# EAGLE design main_unit_shield (EAGLE 7.2.0)
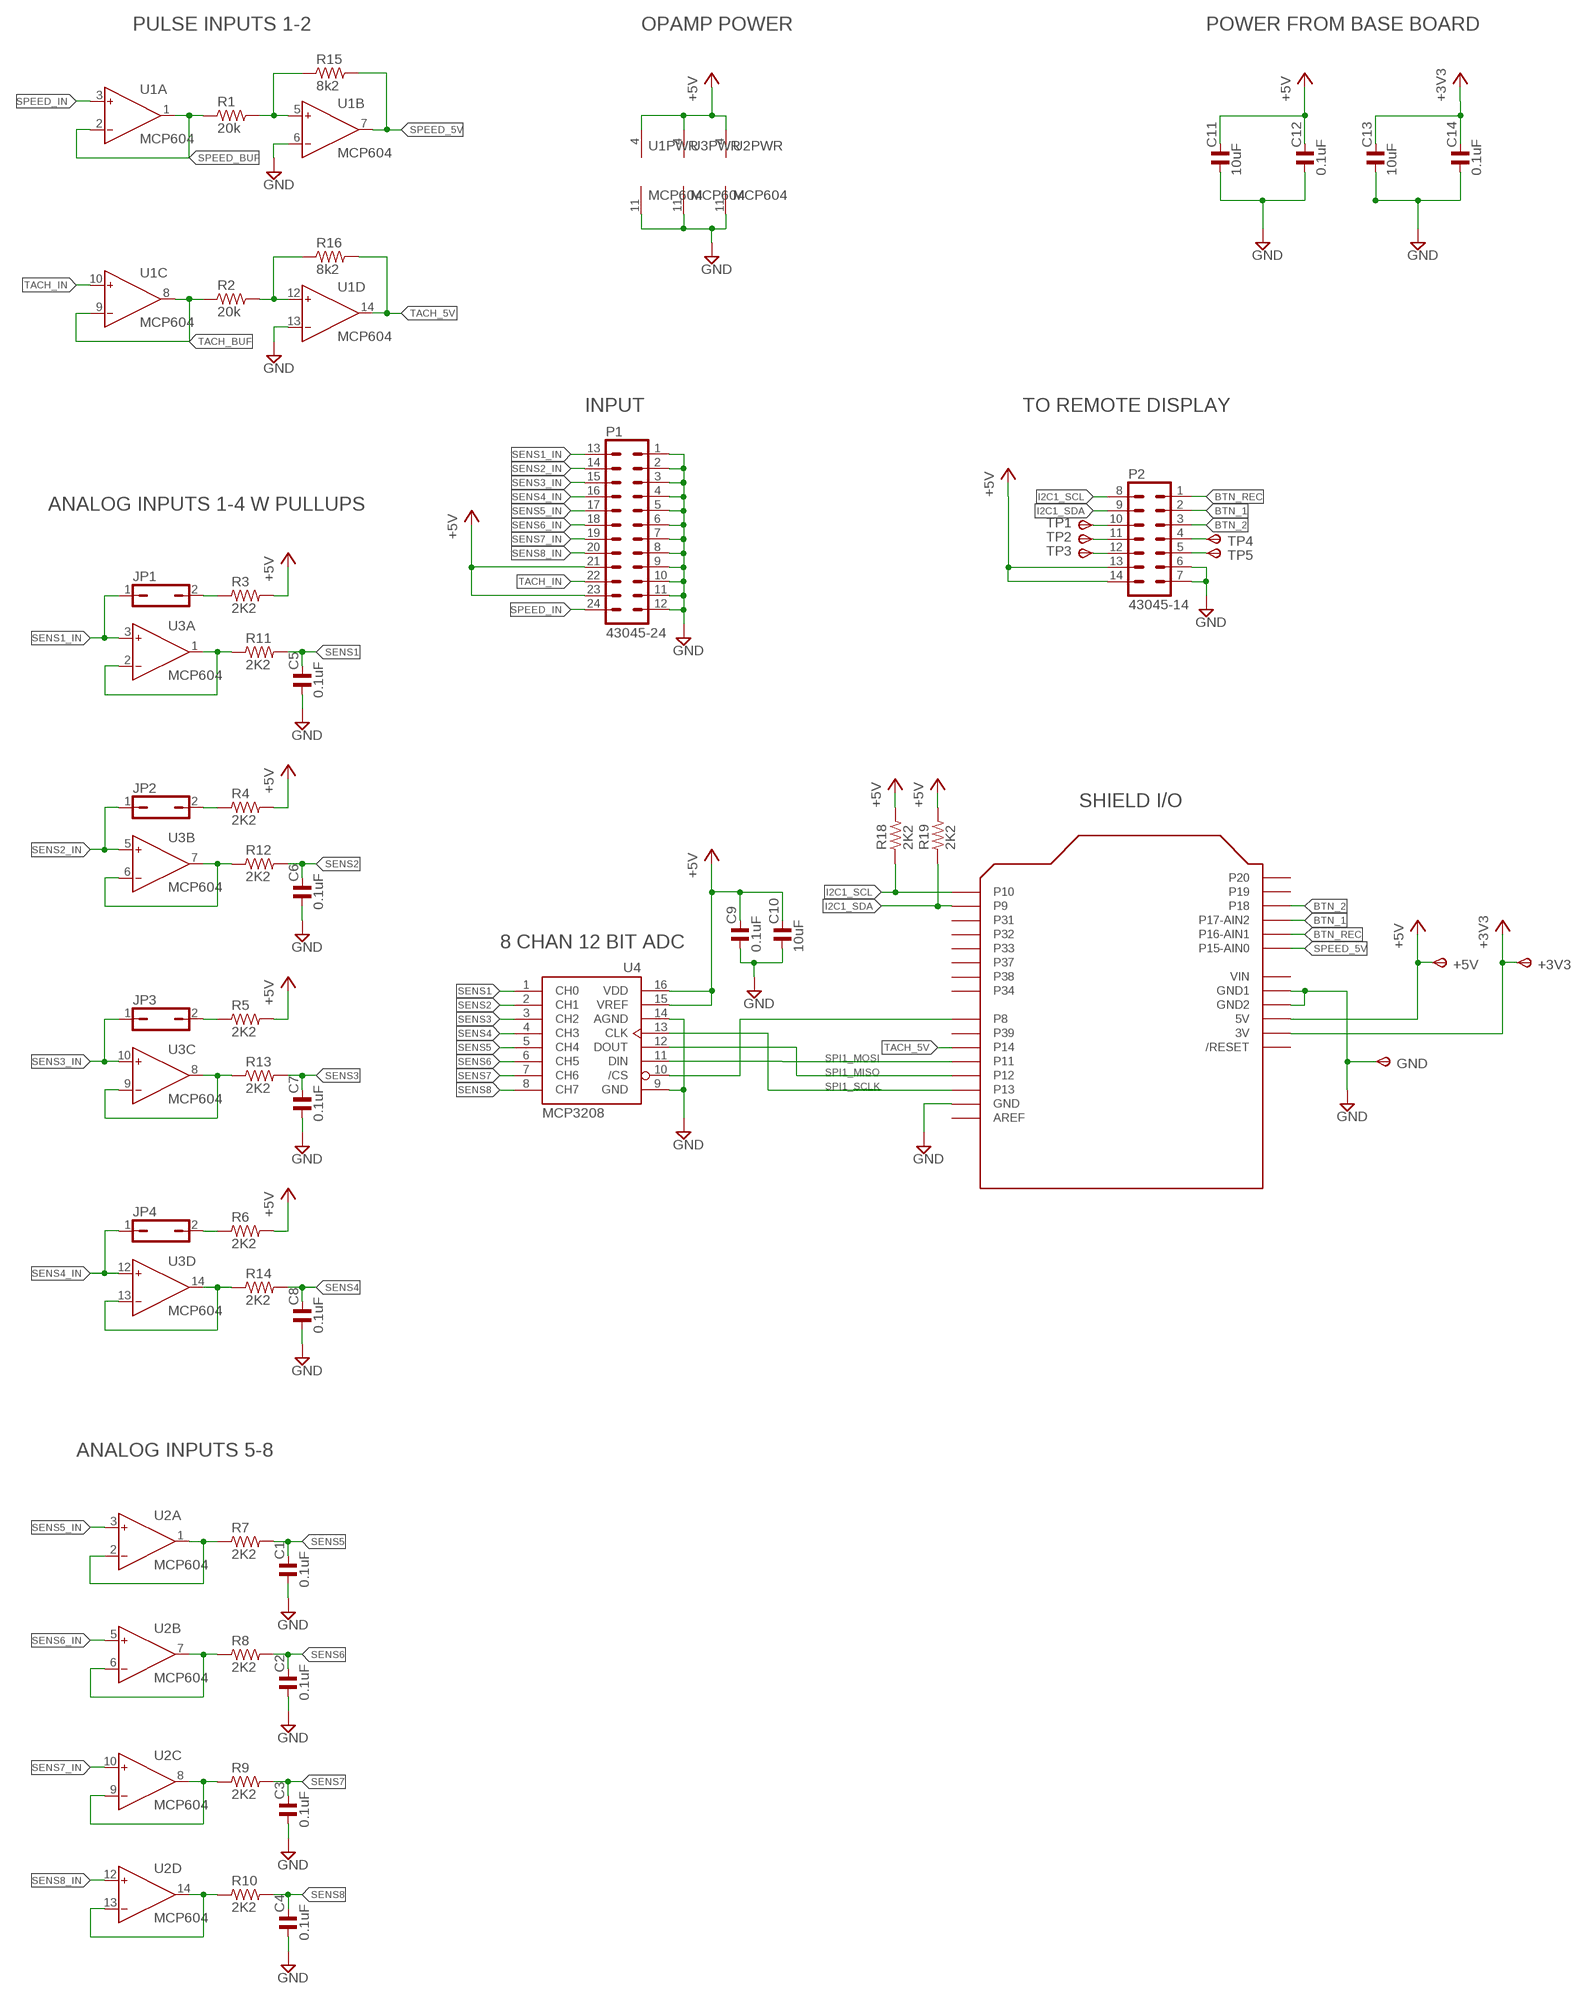
[diagram p0: schematic, sheet 1]

## Parts
+3V3  TPSPAD1-13  [P1-13]
+5V  TPSPAD1-13  [P1-13]
C1  0.1uF  C_0805  [C0805]
C2  0.1uF  C_0805  [C0805]
C3  0.1uF  C_0805  [C0805]
C4  0.1uF  C_0805  [C0805]
C5  0.1uF  C_0805  [C0805]
C6  0.1uF  C_0805  [C0805]
C7  0.1uF  C_0805  [C0805]
C8  0.1uF  C_0805  [C0805]
C9  0.1uF  C_0805  [C0805]
C10  10uF  C_0805  [C0805]
C11  10uF  C_0805  [C0805]
C12  0.1uF  C_0805  [C0805]
C13  10uF  C_0805  [C0805]
C14  0.1uF  C_0805  [C0805]
GND  TPSPAD1-13  [P1-13]
JP1  JP1Q  [JP1]
JP2  JP1Q  [JP1]
JP3  JP1Q  [JP1]
JP4  JP1Q  [JP1]
P1  43045-24  [43045-24]
P2  43045-14  [43045-14]
R1  20k  R_0805  [R0805]
R2  20k  R_0805  [R0805]
R3  2K2  R_0805  [R0805]
R4  2K2  R_0805  [R0805]
R5  2K2  R_0805  [R0805]
R6  2K2  R_0805  [R0805]
R7  2K2  R_0805  [R0805]
R8  2K2  R_0805  [R0805]
R9  2K2  R_0805  [R0805]
R10  2K2  R_0805  [R0805]
R11  2K2  R_0805  [R0805]
R12  2K2  R_0805  [R0805]
R13  2K2  R_0805  [R0805]
R14  2K2  R_0805  [R0805]
R15  8k2  R_0805  [R0805]
R16  8k2  R_0805  [R0805]
R18  2K2  R_0805  [R0805]
R19  2K2  R_0805  [R0805]
TP1  TPSPAD1-13  [P1-13]
TP2  TPSPAD1-13  [P1-13]
TP3  TPSPAD1-13  [P1-13]
TP4  TPSPAD1-13  [P1-13]
TP5  TPSPAD1-13  [P1-13]
U1  MCP604  [SO14]
U2  MCP604  [SO14]
U3  MCP604  [SO14]
U4  MCP3208  [SO16]
U5  ARDUINOUNO  [ARDUINO]

## Nets
+3V3: +3V3.TP(PP) C13.2 C14.2 U5.3V
+5V: +5V.TP(PP) C9.2 C10.2 C11.2 C12.2 P1.21 P1.23 P2.13 P2.14 R3.2 R4.2 R5.2 R6.2 R18.2 R19.2 U1.4(PWR:V+) U2.4(PWR:V+) U3.4(PWR:V+) U4.15(VREF) U4.16(VDD) U5.5V
BTN_1: P2.2 U5.A2(P17-AIN2)
BTN_2: P2.3 U5.A3(P18)
BTN_REC: P2.1 U5.A1(P16-AIN1)
GND: C1.1 C2.1 C3.1 C4.1 C5.1 C6.1 C7.1 C8.1 C9.1 C10.1 C11.1 C12.1 C13.1 C14.1 GND.TP(PP) P1.1 P1.2 P1.3 P1.4 P1.5 P1.6 P1.7 P1.8 P1.9 P1.10 P1.11 P1.12 P2.6 P2.7 U1.6(B:IN-) U1.11(PWR:V-) U1.13(D:IN-) U2.11(PWR:V-) U3.11(PWR:V-) U4.9(GND) U4.14(AGND) U5.GND U5.GND1 U5.GND2
I2C1_SCL: P2.8 R18.1 U5.D0(P10)
I2C1_SDA: P2.9 R19.1 U5.D1(P9)
N$1: R1.2 R15.1 U1.5(B:IN+)
N$3: R2.2 R16.1 U1.12(D:IN+)
N$6: U4.10(/CS) U5.D8(P8)
N$10: JP1.2 R3.1
N$22: JP3.2 R5.1
N$24: P2.10 TP1.TP(PP)
N$25: P2.11 TP2.TP(PP)
N$26: JP2.2 R4.1
N$28: P2.12 TP3.TP(PP)
N$31: JP4.2 R6.1
N$33: P2.4 TP4.TP(PP)
N$36: P2.5 TP5.TP(PP)
SENS1: C5.2 R11.2 U4.1(CH0)
SENS1_BUF: R11.1 U3.1(A:OUT) U3.2(A:IN-)
SENS1_IN: JP1.1 P1.13 U3.3(A:IN+)
SENS2: C6.2 R12.2 U4.2(CH1)
SENS2_BUF: R12.1 U3.6(B:IN-) U3.7(B:OUT)
SENS2_IN: JP2.1 P1.14 U3.5(B:IN+)
SENS3: C7.2 R13.2 U4.3(CH2)
SENS3_BUF: R13.1 U3.8(C:OUT) U3.9(C:IN-)
SENS3_IN: JP3.1 P1.15 U3.10(C:IN+)
SENS4: C8.2 R14.2 U4.4(CH3)
SENS4_BUF: R14.1 U3.13(D:IN-) U3.14(D:OUT)
SENS4_IN: JP4.1 P1.16 U3.12(D:IN+)
SENS5: C1.2 R7.2 U4.5(CH4)
SENS5_BUF: R7.1 U2.1(A:OUT) U2.2(A:IN-)
SENS5_IN: P1.17 U2.3(A:IN+)
SENS6: C2.2 R8.2 U4.6(CH5)
SENS6_BUF: R8.1 U2.6(B:IN-) U2.7(B:OUT)
SENS6_IN: P1.18 U2.5(B:IN+)
SENS7: C3.2 R9.2 U4.7(CH6)
SENS7_BUF: R9.1 U2.8(C:OUT) U2.9(C:IN-)
SENS7_IN: P1.19 U2.10(C:IN+)
SENS8: C4.2 R10.2 U4.8(CH7)
SENS8_BUF: R10.1 U2.13(D:IN-) U2.14(D:OUT)
SENS8_IN: P1.20 U2.12(D:IN+)
SPEED_5V: R15.2 U1.7(B:OUT) U5.A0(P15-AIN0)
SPEED_BUF: R1.1 U1.1(A:OUT) U1.2(A:IN-)
SPEED_IN: P1.24 U1.3(A:IN+)
SPI1_MISO: U4.12(DOUT) U5.D12(P12)
SPI1_MOSI: U4.11(DIN) U5.D11(P11)
SPI1_SCLK: U4.13(CLK) U5.D13(P13)
TACH_5V: R16.2 U1.14(D:OUT) U5.D10(P14)
TACH_BUF: R2.1 U1.8(C:OUT) U1.9(C:IN-)
TACH_IN: P1.22 U1.10(C:IN+)
Unconnected: U5.A4(P19) U5.A5(P20) U5.AREF U5.D2(P31) U5.D3(P32) U5.D4(P33) U5.D5(P37) U5.D6(P38) U5.D7(P34) U5.D9(P39) U5.RESET(/RESET)

## Notes on the sheet
- PULSE INPUTS 1-2 | OPAMP POWER | POWER FROM BASE BOARD
- INPUT | TO REMOTE DISPLAY
- ANALOG INPUTS 1-4 W PULLUPS
- SHIELD I/O
- 8 CHAN 12 BIT ADC
- ANALOG INPUTS 5-8

## Power pins joined to a net without a drawn wire
VIN: U5.VIN

## Library data of the parts
+3V3 +5V GND TP1-TP5 = testpad:TPS: TEST PIN; OC_NEWARK: unknown
C1-C9 C12 C14 = rc-master-smd:C_: NON-POLARIZED CAP; MPN: C2012X7R1H104K085AA; OC_NEWARK: 04X3288
C10 C11 C13 = rc-master-smd:C_: NON-POLARIZED CAP; MPN: C2012X5R1E106K125AB; OC_NEWARK: 04X3278
JP1-JP4 = jumper:JP1Q: JUMPER; MPN: 969102-0000-DA; OC_NEWARK: 10R6270
P1 = con-molex-micro-fit:43045-24: HEADER; MF: MOLEX; MPN: 43045-2400; OC_NEWARK: 56H9717
P2 = con-molex-micro-fit:43045-14: HEADER; MPN: 43045-1400; OC_NEWARK: 55R8852
R1 R2 = rc-master-smd:R_: RESISTOR; MF: VISHAY/DALE; MPN: CRCW080520K0FKEA; OC_NEWARK: 52K9995
R3-R14 R18 R19 = rc-master-smd:R_: RESISTOR; MF: VISHAY/DALE; MPN: CRCW08052K20FKEA; OC_NEWARK: 52K9951
R15 R16 = rc-master-smd:R_: RESISTOR; MPN: CRCW08058K20FKEAHP; OC_NEWARK: 41R4811
U1-U3 = dan:MCP604; MPN: MCP6044-E/SL; OC_NEWARK: 56J7441
U4 = dan:MCP3208; MF: MICROCHIP; MPN: MCP3208-BI/SL; OC_NEWARK: 23C2843
U5 = adafruit:ARDUINO: Arduino Diecimila/Duemilanove Make a shield with ease, this package has all the named pins as well as the two mounting drill holes and an outline of the USB and DC power connector. The outline is on the DIMENSION layer, so if your board house uses it they will cut the outline to match. http://www.ladyada.net/library/pcb/eaglelibrary.html; OC_NEWARK: unknown

## Board
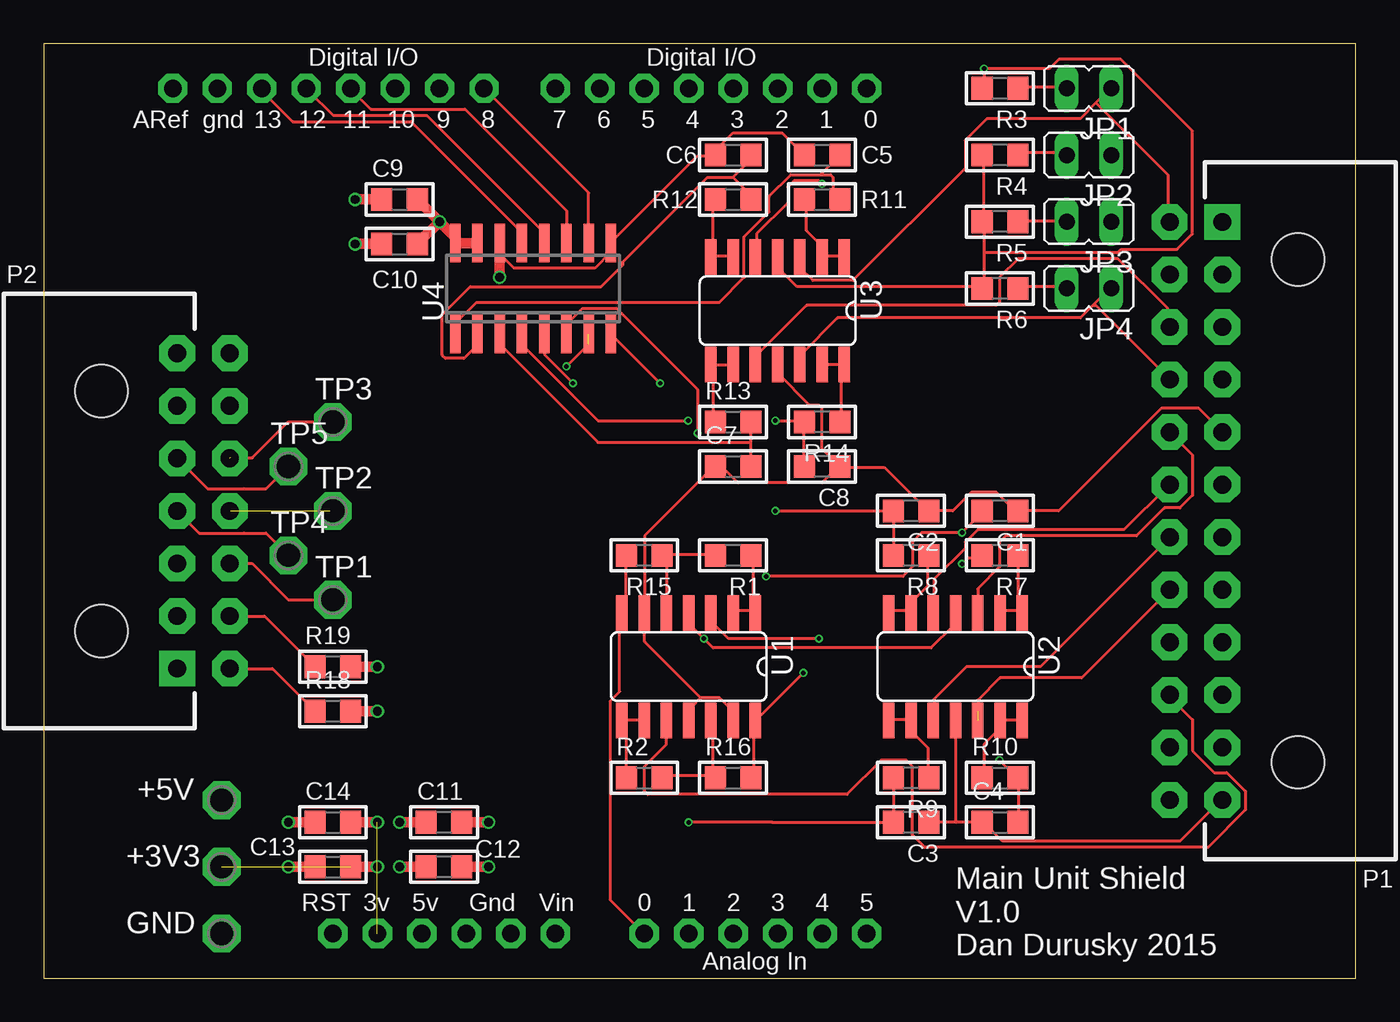
[diagram p1: board, top side]
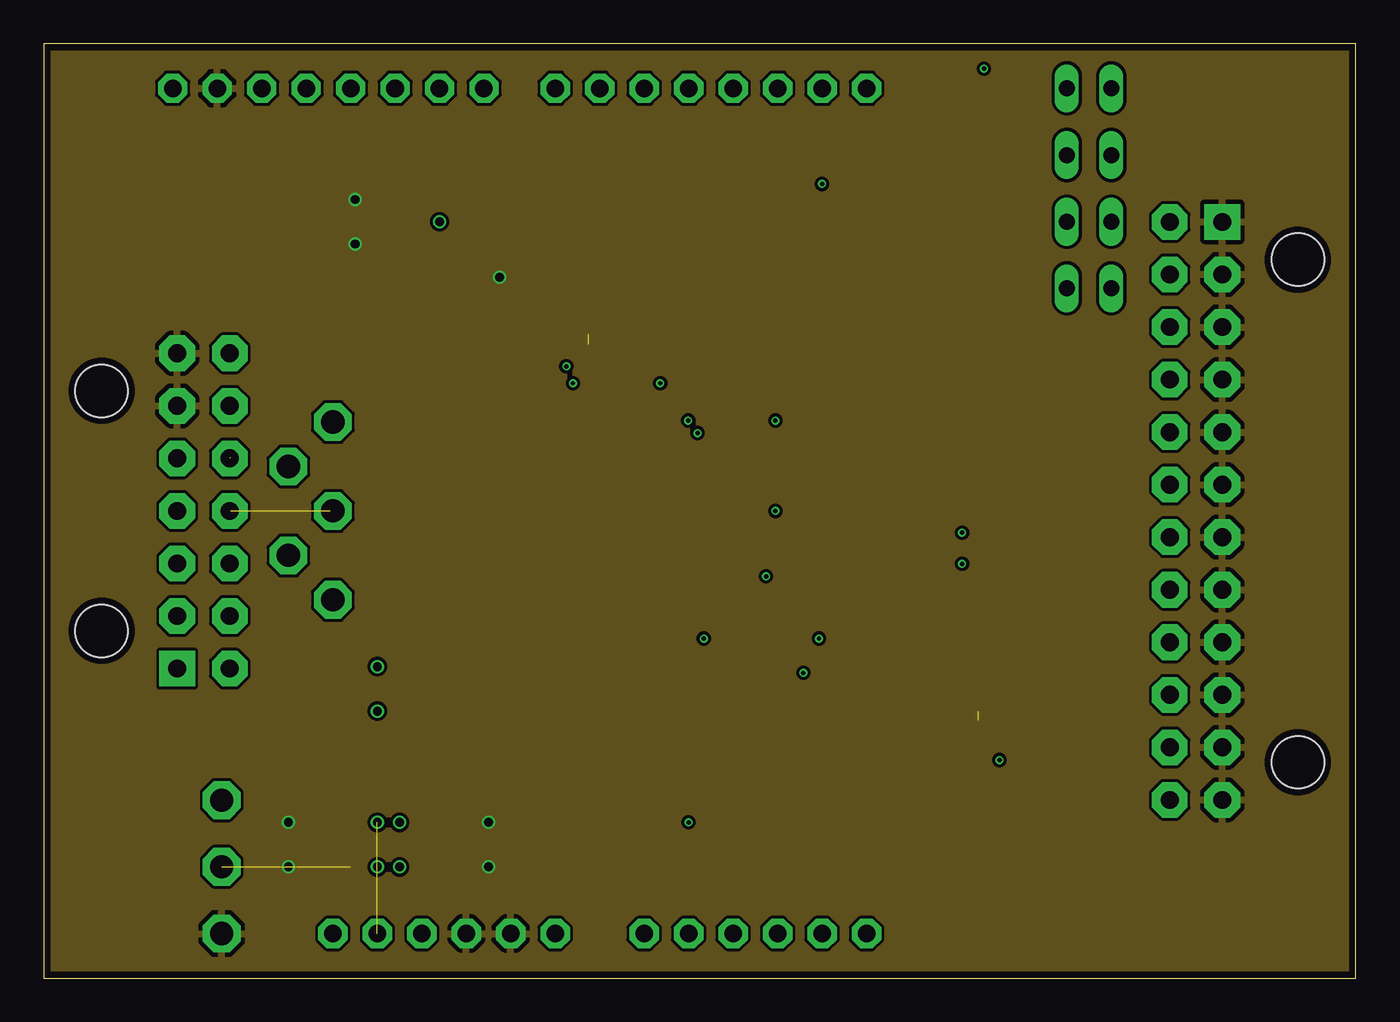
[diagram p2: board, inner layer GroundPlane]
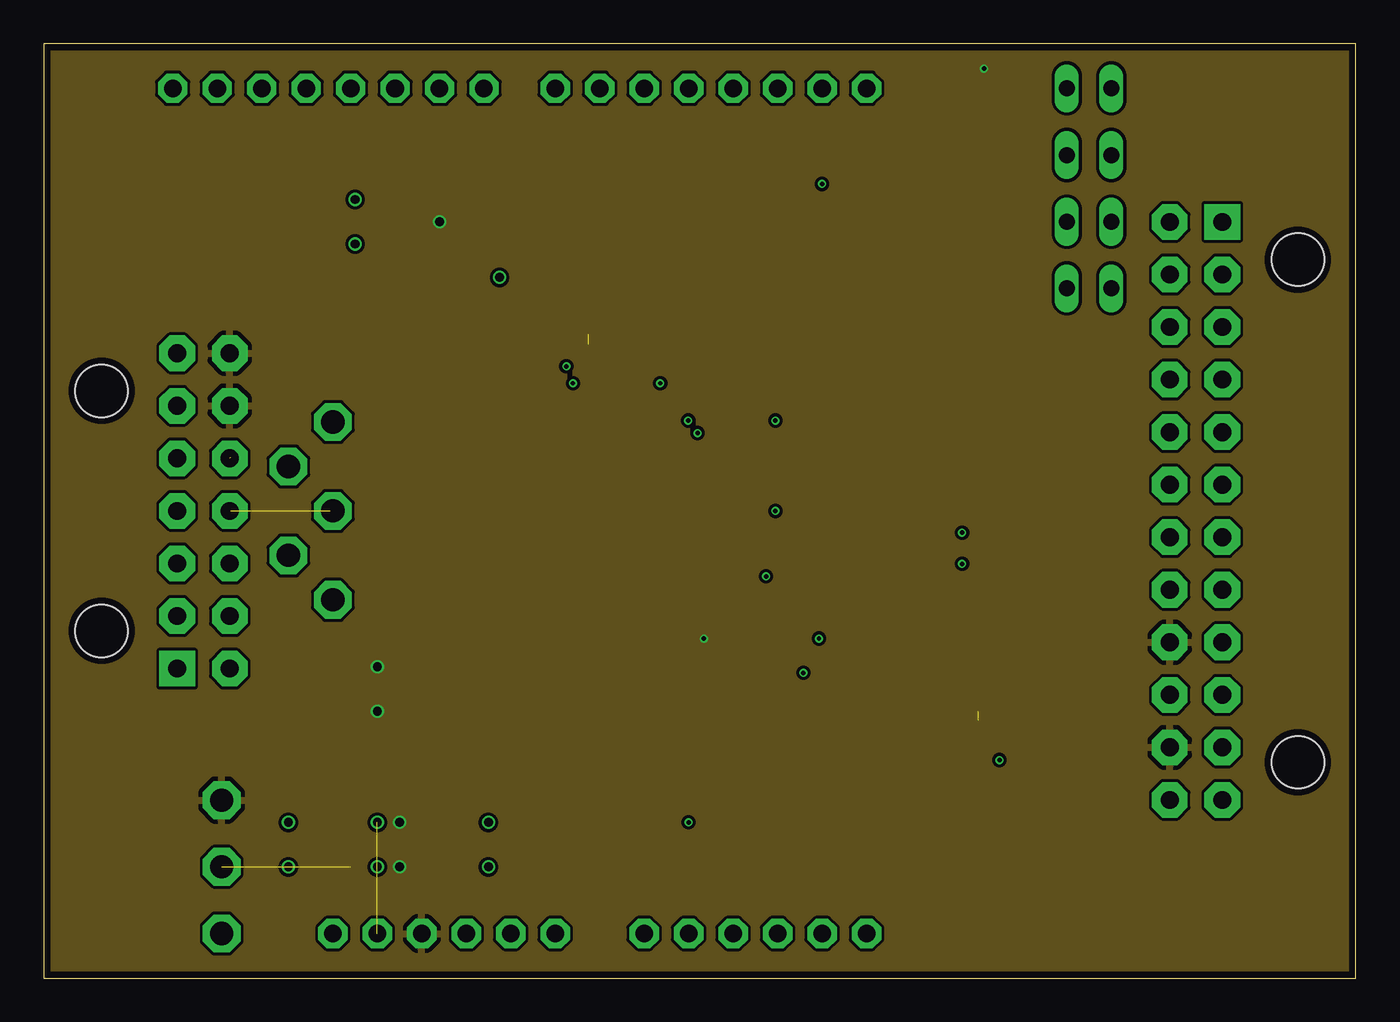
[diagram p3: board, inner layer PowerPlane]
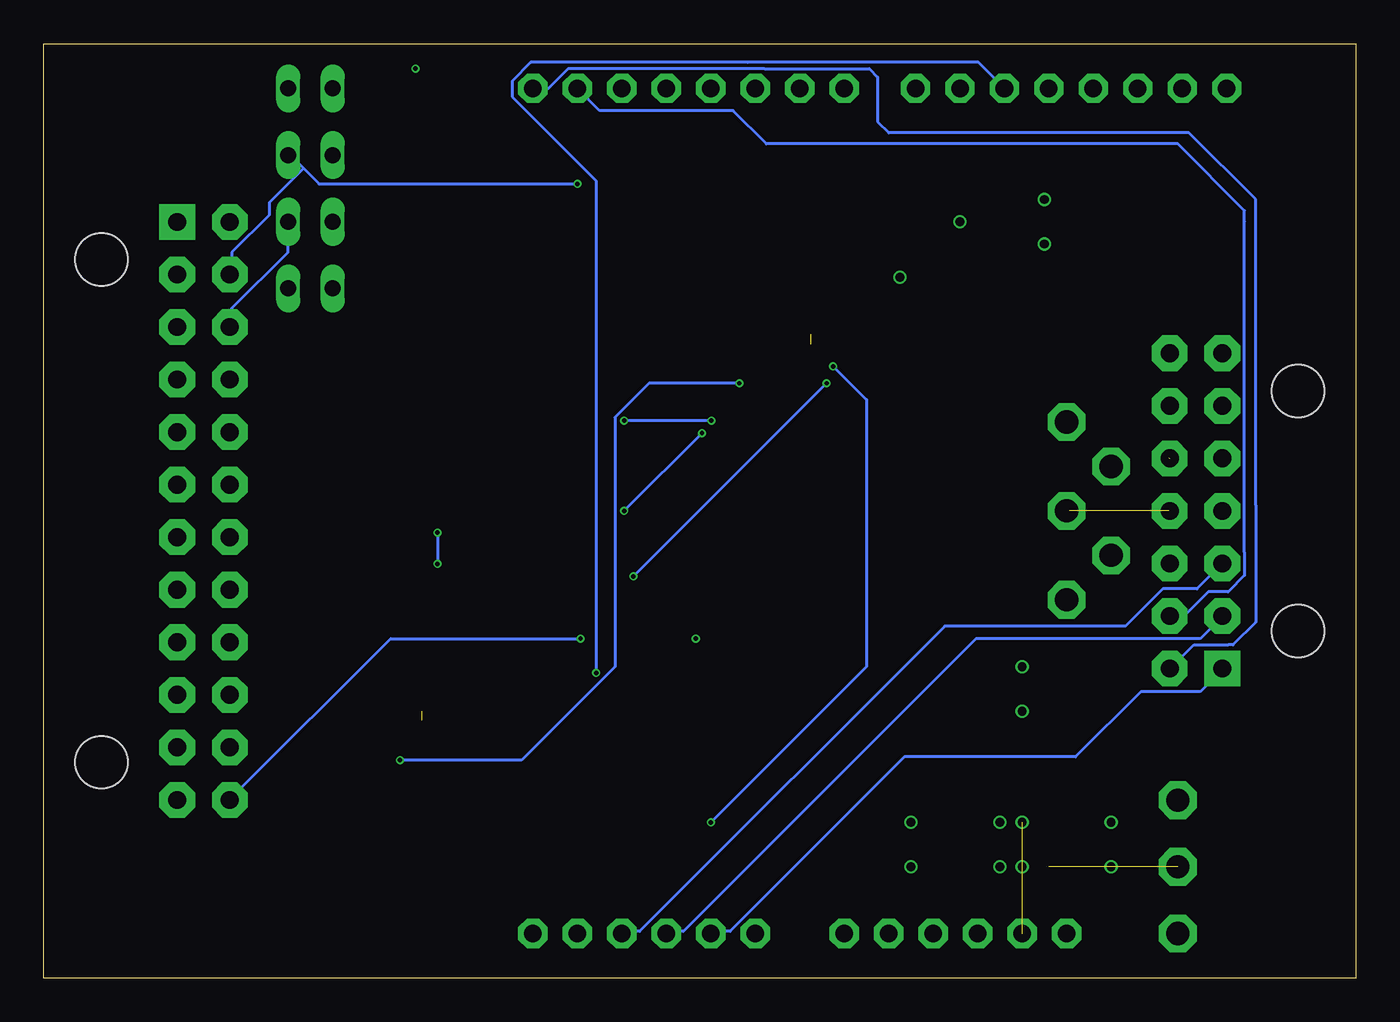
[diagram p4: board, bottom side, seen from below]

Size 74.93 x 53.34 mm. Coordinates in mm from the lower left corner, seen from the top.
Copper layers (1*2*15*16): Top 0.035559375mm / dielectric 0.17018125mm / GroundPlane 0.01778125mm / dielectric 47mil / PowerPlane 0.01778125mm / dielectric 0.17018125mm / Bottom 0.035559375mm
Design rules "OSHPark-4layer *": minimum track width 7mil, minimum drill 10mil, track to track 7mil, track to pad 7mil, pad to pad 7mil, via to via 7mil, smd to smd 7mil, copper to edge 15mil, drill to drill 6mil, minimum pad ring 4mil, minimum via ring 4mil, stop-mask expansion 4mil, vias tented up to drill 0mil, thermal gap 10mil

### Footprints (pad centres in the part's own frame; a part is rotated, then mirrored left to right if it is on the bottom)
P1-13 = drill 1.321 pad 2.159 octagon: TP 0,0
C0805 = smd 1.2 x 1.3: 1 -1.016,0; 2 1.016,0
JP1 = drill 0.914 long: 1 0,-1.27; 2 0,1.27
43045-24 = drill 1.016 pad 2.032 square: 1 16.5,0 | drill 1.016 pad 2.032 octagon: 2 13.5,0; 3 10.5,0; 4 7.5,0; 5 4.5,0; 6 1.5,0; 7 -1.5,0; 8 -4.5,0; 9 -7.5,0; 10 -10.5,0; 11 -13.5,0; 12 -16.5,0; 13 16.5,3; 14 13.5,3; 15 10.5,3; 16 7.5,3; 17 4.5,3; 18 1.5,3; 19 -1.5,3; 20 -4.5,3; 21 -7.5,3; 22 -10.5,3; 23 -13.5,3; 24 -16.5,3 | hole 3: -14.35,-4.32; 14.35,-4.32
43045-14 = drill 1.016 pad 2.032 square: 1 9,0 | drill 1.016 pad 2.032 octagon: 2 6,0; 3 3,0; 4 0,0; 5 -3,0; 6 -6,0; 7 -9,0; 8 9,3; 9 6,3; 10 3,3; 11 0,3; 12 -3,3; 13 -6,3; 14 -9,3 | hole 3: -6.85,-4.32; 6.85,-4.32
R0805 = smd 1.2 x 1.3: 1 -1.016,0; 2 1.016,0
SO14 = smd 0.66 x 2.032: 1 -3.81,-3.073; 2 -2.54,-3.073; 3 -1.27,-3.073; 4 0,-3.073; 5 1.27,-3.073; 6 2.54,-3.073; 7 3.81,-3.073; 8 3.81,3.073; 9 2.54,3.073; 10 1.27,3.073; 11 0,3.073; 12 -1.27,3.073; 13 -2.54,3.073; 14 -3.81,3.073
SO16 = smd 0.6 x 2.2: 1 -4.445,-2.6; 2 -3.175,-2.6; 3 -1.905,-2.6; 4 -0.635,-2.6; 5 0.635,-2.6; 6 1.905,-2.6; 7 3.175,-2.6; 8 4.445,-2.6; 9 4.445,2.6; 10 3.175,2.6; 11 1.905,2.6; 12 0.635,2.6; 13 -0.635,2.6; 14 -1.905,2.6; 15 -3.175,2.6; 16 -4.445,2.6
ARDUINO = drill 1 pad 1.676 octagon: 3V 19.05,2.54; 5V 21.59,2.54; A0 34.29,2.54; A1 36.83,2.54; A2 39.37,2.54; A3 41.91,2.54; A4 44.45,2.54; A5 46.99,2.54; AREF 7.366,50.8; D0 46.99,50.8; D1 44.45,50.8; D2 41.91,50.8; D3 39.37,50.8; D4 36.83,50.8; D5 34.29,50.8; D6 31.75,50.8; D7 29.21,50.8; D8 25.146,50.8; D9 22.606,50.8; D10 20.066,50.8; D11 17.526,50.8; D12 14.986,50.8; D13 12.446,50.8; GND 9.906,50.8; GND1 26.67,2.54; GND2 24.13,2.54; RESET 16.51,2.54; VIN 29.21,2.54

### Placement (x,y rotation side)
+3V3  10.16,6.35 0 top
+5V  10.16,10.16 0 top
C1  54.61,26.67 180 top
C2  49.53,26.67 180 top
C3  49.53,8.89 180 top
C4  54.61,8.89 0 top
C5  44.45,46.99 0 top
C6  39.37,46.99 0 top
C7  39.37,29.21 0 top
C8  44.45,29.21 180 top
C9  20.32,44.45 0 top
C10  20.32,41.91 0 top
C11  22.86,8.89 180 top
C12  22.86,6.35 180 top
C13  16.51,6.35 0 top
C14  16.51,8.89 0 top
GND  10.16,2.54 0 top
JP1  59.69,50.8 90 top
JP2  59.69,46.99 90 top
JP3  59.69,43.18 90 top
JP4  59.69,39.37 90 top
P1  67.31,26.67 90 top
P2  7.62,26.67 270 top
R1  39.37,24.13 180 top
R2  34.29,11.43 0 top
R3  54.61,50.8 180 top
R4  54.61,46.99 180 top
R5  54.61,43.18 180 top
R6  54.61,39.37 180 top
R7  54.61,24.13 180 top
R8  49.53,24.13 180 top
R9  49.53,11.43 180 top
R10  54.61,11.43 0 top
R11  44.45,44.45 0 top
R12  39.37,44.45 0 top
R13  39.37,31.75 0 top
R14  44.45,31.75 180 top
R15  34.29,24.13 180 top
R16  39.37,11.43 0 top
R18  16.51,15.24 0 top
R19  16.51,17.78 0 top
TP1  16.51,21.59 0 top
TP2  16.51,26.67 0 top
TP3  16.51,31.75 0 top
TP4  13.97,24.13 0 top
TP5  13.97,29.21 0 top
U1  36.83,17.78 180 top
U2  52.07,17.78 180 top
U3  41.91,38.1 180 top
U4  27.94,39.37 0 top
U5  0,0 0 top

### Tracks (layer width: path | path; a pad name or v marks a point on that pad's centre or on a via)
+3V3  (via drill 0.5)  (3 unrouted)
  Top 0.61: v19.05,8.89 C14.2 | v19.05,6.35 C13.2
+5V  (via drill 0.25, 0.5)
  Top 0.178: U1.4 36.98,20.8 36.98,20.09 v37.69,19.38 38.23,18.85 50.67,18.85 51.92,20.09 51.92,20.8 U2.4 | 23.65,41.96 U4.16 | 24.71,41.96 U4.15 | 21.87,6.4 C12.2 21.69,6.22 | R3.2 53.7,50.85 v53.7,51.92 57.43,51.92 57.96,52.45 61.52,52.45 65.61,48.36 65.61,42.49 64.72,41.6 61.52,41.6 61.34,41.43 53.7,41.43 | 53.7,41.43 53.7,43.03 R5.2 53.7,43.2 53.7,46.94 R4.2 | 53.7,41.43 53.7,39.47 R6.2 53.52,39.47 43.03,39.47 41.96,40.54 41.96,41.07 U3.4
  Top 0.61: v20.32,8.89 C11.2 | v20.32,6.35 C12.2 | 23.5,41.91 U4.16 | U4.15 24.76,41.96 U4.16 | v19.05,17.78 R19.2 | v19.05,15.24 R18.2 | 21.39,41.96 C10.2 v22.61,43.18 | C9.2 v22.61,43.18 | U4.16 23.5,42.28 v22.61,43.18
  pour PowerPlane: -1.27,54.61 76.2,54.61 76.2,-1.27 -1.27,-1.27
BTN_1
  Bottom 0.178: U5.A2 39.29,2.67 38.41,2.67 21.69,19.38 8.89,19.38 7.64,20.62 P2.2
BTN_2
  Bottom 0.178: U5.A3 41.78,2.67 40.89,2.67 23.47,20.09 13.16,20.09 11.02,22.23 9.07,22.23 7.64,23.65 P2.3
BTN_REC
  Bottom 0.178: U5.A1 36.8,2.67 35.74,2.67 25.78,12.62 16,12.62 12.27,16.36 8.89,16.36 7.64,17.6 P2.1
GND  (via drill 0.5)
  Top 0.178: 37.52,16 36.98,15.47 36.98,14.76 U1.11 | 37.52,16 38.58,16 39.29,15.29 39.29,14.76 U1.13 | 37.52,16 34.31,19.2 34.31,20.8 U1.6 34.31,20.98 34.31,25.25 38.23,29.16 C7.1 38.41,29.16 38.76,29.16 39.65,28.27 44.45,28.27 45.34,29.16 C8.1 | U3.11 41.96,35.03 41.96,34.49 43.74,32.72 44.27,32.72 44.45,32.54 44.45,30.23 45.34,29.34 C8.1 | C8.1 45.52,29.16 48.01,29.16 50.49,26.67 C2.1 50.67,26.67 51.92,26.67 52.98,27.74 54.41,27.74 55.47,26.67 C1.1 55.65,26.67 57.96,26.67 63.83,32.54 65.96,32.54 67.21,31.29 P1.5 | 43.38,47.12 C5.1 42.16,48.26 41.91,48.26 39.37,48.26 38.76,47.65 38.76,47.12 38.41,47.12 C6.1 38.23,46.94 37.34,46.94 32.54,42.14 U4.9 32.36,41.96 32.36,41.43 31.47,40.54 26.85,40.54 26.14,41.25 26.14,41.96 U4.14 | 52.09,8.89 53.52,8.89 C4.1 53.7,8.89 54.76,7.82 64.9,7.82 67.21,10.13 P1.12 | 52.09,8.89 50.67,8.89 C3.1 | 52.09,8.89 52.09,14.58 U2.11 | 23.82,6.4 C12.1 24,6.22 | 23.82,8.89 C11.1
  Top 0.61: v13.97,8.89 C14.1 | v13.97,6.35 C13.1 | v25.4,6.35 C12.1 | v25.4,8.89 C11.1 | v17.78,41.91 C10.1 | v26.04,40.01 U4.14 | v17.78,44.45 C9.1
  pour GroundPlane: -1.27,97.79 153.67,97.79 153.67,-1.27 -1.27,-1.27
  pour GroundPlane: -1.27,54.61 76.2,54.61 76.2,-1.27 -1.27,-1.27
I2C1_SCL
  Top 0.178: P2.8 13.06,17.67 R18.1
  Bottom 0.178: P2.8 10.49,17.78 9.25,19.02 7.29,19.02 7.01,19.02 5.71,20.32 5.71,27 5.71,44.45 9.53,48.26 26.67,48.26 27.3,48.9 27.3,51.44 27.79,51.92 33.78,51.92 44.98,51.92 46.1,50.8 U5.D0
I2C1_SDA
  Top 0.178: P2.9 12.6,20.67 R19.1
  Bottom 0.178: U5.D1 43.18,49.53 41.91,49.53 35.56,49.53 33.66,47.62 10.16,47.62 6.35,43.81 6.35,43.18 6.35,24.31 6.35,22.99 7.29,22.05 8.43,22.05 8.89,21.59 9.81,20.67 P2.9
N$1
  Top 0.178: 35.56,24.18 38.23,24.18 R1.2 | 35.56,24.18 35.38,24.18 R15.1 35.56,24.18 | 35.56,24.18 35.56,20.98 U1.5
N$3
  Top 0.178: 38.23,11.56 35.38,11.56 R2.2 | 38.23,11.56 R16.1 38.23,11.56 | 38.23,11.56 38.23,14.58 U1.12
N$6
  Top 0.178: U4.10 31.11,42.14 31.11,44.83 U5.D8
N$10
  Top 0.178: R3.1 55.65,50.85 58.32,50.85 JP1.2
N$22
  Top 0.178: R5.1 55.65,43.2 58.32,43.2 JP3.2
N$24
  Top 0.178: P2.10 11.89,23.67 13.97,21.59 TP1.TP
N$25  (1 unrouted)
  Top 0.178: 10.67,26.67 P2.11 | 16.36,26.67 TP2.TP
N$26
  Top 0.178: R4.1 55.65,47.12 58.32,47.12 JP2.2
N$28  (1 unrouted)
  Top 0.178: 10.67,29.69 11.91,29.69 13.97,31.75 TP3.TP
N$31
  Top 0.178: R6.1 55.65,39.47 58.32,39.47 JP4.2
N$33
  Top 0.178: P2.4 8.89,25.4 11.43,25.4 12.7,25.4 TP4.TP
N$36
  Top 0.178: P2.5 9.35,27.94 11.43,27.94 12.7,27.94 TP5.TP
SENS1
  Top 0.178: 45.52,44.45 R11.2 45.09,44.83 45.09,45.72 44.93,45.87 44.35,45.87 | 45.52,46.94 C5.2 44.35,45.87 | U4.1 23.65,36.8 23.65,37.52 24.71,38.58 38.58,38.58 40.01,40.01 40.01,42.32 41.43,43.74 41.43,44.63 42.67,45.87 44.35,45.87
SENS1_BUF
  Top 0.178: 44.45,41.25 44.45,41.78 43.56,42.67 43.56,44.45 R11.1 | 44.45,41.25 U3.2 44.45,41.25 | 44.45,41.25 45.7,41.25 U3.1
SENS1_IN
  Top 0.178: 60.1,49.96 60.81,50.67 JP1.1 | 60.1,49.96 59.21,49.07 53.87,49.07 52.63,47.83 52.63,46.23 46.23,39.83 43.92,39.83 43.2,40.54 43.2,41.07 U3.3 | 60.1,49.96 64.19,45.87 64.19,43.2 P1.13
SENS2
  Top 0.178: 40.36,44.45 R12.2 40.39,44.7 39.37,45.72 | 40.36,46.94 C6.2 40.39,46.74 39.37,45.72 | U4.2 24.71,36.63 24.71,36.09 24,35.38 22.94,35.38 22.76,35.56 22.76,37.87 24.36,39.47 31.83,39.47 33.07,40.72 33.07,40.89 37.69,45.52 37.9,45.72 39.37,45.72
SENS2_BUF
  Top 0.178: 38.23,41.25 38.23,44.45 R12.1 | 38.23,41.25 U3.7 38.23,41.25 | 38.23,41.25 39.29,41.25 U3.6
SENS2_IN  (via drill 0.25)
  Top 0.178: v44.45,45.34 44.27,45.52 42.85,45.52 42.49,45.16 42.49,44.27 40.72,42.49 40.72,41.25 U3.5
  Bottom 0.178: v44.45,45.34 59.21,45.34 60.1,46.23 | 60.1,46.23 60.81,46.94 JP2.1 | 60.1,46.23 62.05,44.27 62.05,43.56 64.19,41.43 64.19,40.18 P1.14
SENS3
  Top 0.178: 40.36,30.58 40.36,31.65 R13.2 | 40.36,30.58 40.36,29.34 C7.2 | 40.36,30.58 31.65,30.58 26.14,36.09 26.14,36.63 U4.3
SENS3_BUF
  Top 0.178: 38.23,35.03 38.23,31.83 R13.1 | 38.23,35.03 U3.8 38.23,35.03 | 38.23,35.03 39.29,35.03 U3.9
SENS3_IN
  Top 0.178: U3.10 40.72,35.03 40.72,35.56 43.56,38.41 54.41,38.41 54.59,38.58 54.59,40.01 55.65,41.07 61.34,41.07 64.19,38.23 64.19,37.34 P1.15
  Bottom 0.178: JP3.1 60.98,43.03 60.98,41.43 64.19,38.23 64.19,37.34 P1.15
SENS4  (via drill 0.25)
  Top 0.178: C8.2 43.38,29.34 43.38,31.65 R14.2 43.38,31.83 v41.78,31.83 | v36.8,31.83 31.65,31.83 27.38,36.09 27.38,36.63 U4.4
  Bottom 0.178: v36.8,31.83 v41.78,31.83
SENS4_BUF
  Top 0.178: 45.7,35.03 45.52,34.85 45.52,31.83 R14.1 | 45.7,35.03 U3.14 45.7,35.03 | 45.7,35.03 U3.13
SENS4_IN
  Top 0.178: 59.92,38.41 60.81,39.29 JP4.1 | 59.92,38.41 59.21,37.69 45.34,37.69 43.2,35.56 43.2,35.03 U3.12 | 59.92,38.41 60.1,38.41 64.19,34.31 P1.16
SENS5  (via drill 0.25)
  Top 0.178: v52.45,23.65 52.81,24 53.52,24 R7.2 | C1.2 53.7,26.67 v52.45,25.43 50.14,25.43 49.61,24.89 49.61,23.47 49.07,22.94 v41.25,22.94 | v30.23,33.96 28.63,35.56 28.63,36.63 U4.5
  Bottom 0.178: v52.45,25.43 v52.45,23.65 | v41.25,22.94 v30.23,33.96
SENS5_BUF
  Top 0.178: 55.83,20.98 55.65,21.16 55.65,24 R7.1 | 55.83,20.98 U2.1 55.83,20.98 | 55.83,20.98 54.76,20.98 U2.2
SENS5_IN
  Top 0.178: U2.3 53.34,20.98 53.34,22.23 54.59,23.47 54.59,24.89 54.94,25.25 62.41,25.25 64.01,26.85 64.9,26.85 65.61,27.56 65.61,29.87 64.36,31.11 P1.17
SENS6  (via drill 0.25)
  Top 0.178: R8.2 48.54,24.18 48.54,26.67 C2.2 48.36,26.67 v41.78,26.67 | v37.34,31.11 37.34,33.6 32.72,38.23 30.76,38.23 29.87,37.34 29.87,36.8 U4.6
  Bottom 0.178: v37.34,31.11 v41.78,26.67
SENS6_BUF
  Top 0.178: R8.1 50.49,24 50.49,22.4 49.61,21.51 49.61,20.98 U2.6 49.43,20.98 48.36,20.98 U2.7
SENS6_IN
  Top 0.178: U2.5 50.85,20.98 50.85,22.76 52.63,24.54 52.63,24.89 53.34,25.6 61.7,25.6 64.19,28.09 P1.18
SENS7  (via drill 0.25)  (1 unrouted)
  Top 0.178: R9.2 48.54,11.38 48.54,8.89 C3.2 48.36,8.89 41.6,8.89 v36.83,8.89 | v29.84,34.92 31.11,36.2
  Bottom 0.178: v36.83,8.89 27.94,17.78 27.94,33.02 v29.84,34.92
SENS7_BUF
  Top 0.178: R9.1 50.49,11.56 50.49,13.16 49.61,14.05 49.61,14.58 U2.9 49.43,14.76 48.36,14.76 U2.8
SENS7_IN
  Top 0.178: U2.10 50.85,14.76 50.85,15.29 50.85,15.93 52.7,17.78 56.92,17.78 P1.19
SENS8  (via drill 0.25)
  Top 0.178: C4.2 55.65,8.89 55.65,11.38 R10.2 55.47,11.56 v54.59,12.45 | v35.2,33.96 32.54,36.63 U4.8
  Bottom 0.178: v54.59,12.45 47.65,12.45 42.32,17.78 42.32,32 40.36,33.96 v35.2,33.96
SENS8_BUF
  Top 0.178: R10.1 53.7,11.56 53.7,13.34 54.59,14.22 54.59,14.58 U2.13 54.76,14.76 55.83,14.76 U2.14
SENS8_IN  (1 unrouted)
  Top 0.178: P1.20 59.28,17.14 54.61,17.14 53.34,15.88 53.34,15.24
SPEED_5V
  Top 0.178: R15.2 33.25,24 33.25,21.16 33.07,20.98 U1.7 32.89,20.8 32.89,16.36 32.36,15.82 32.36,4.45 34.14,2.67 U5.A0
SPEED_BUF
  Top 0.178: 40.54,20.98 40.54,24 R1.1 | 40.54,20.98 U1.1 40.54,20.98 | 40.54,20.98 39.47,20.98 U1.2
SPEED_IN  (via drill 0.25)
  Top 0.178: v44.27,19.38 39.12,19.38 38.23,20.27 38.23,20.8 U1.3
  Bottom 0.178: v44.27,19.38 55.12,19.38 64.19,10.31 P1.24
SPI1_MISO
  Top 0.178: U4.12 28.45,42.14 28.45,42.67 21.87,49.25 16.54,49.25 15.11,50.67 U5.D12
SPI1_MOSI
  Top 0.178: 29.69,42.14 U4.11 29.84,43.81 24.05,49.61 18.67,49.61 17.6,50.67 U5.D11
SPI1_SCLK
  Top 0.178: U4.13 27.2,42.14 27.2,42.67 20.98,48.9 14.22,48.9 12.45,50.67 U5.D13
TACH_5V  (via drill 0.25)
  Top 0.178: R16.2 40.54,11.56 40.54,14.58 U1.14 40.72,14.76 v43.38,17.42
  Bottom 0.178: v43.38,17.42 43.38,45.52 48.18,50.32 48.18,51.21 47.12,52.27 34.72,52.27 21.54,52.27 U5.D10
TACH_BUF
  Top 0.178: R2.1 33.25,11.56 33.25,14.4 33.07,14.58 U1.8 33.07,14.76 34.14,14.76 U1.9
TACH_IN
  Top 0.178: U1.10 35.56,14.58 35.56,13.34 34.31,12.09 34.31,10.67 34.49,10.49 45.87,10.49 47.83,12.45 49.25,12.45 49.61,12.09 49.61,8.18 50.32,7.47 66.5,7.47 68.63,9.6 68.63,10.67 67.56,11.73 66.85,11.73 65.61,12.98 65.61,14.76 64.36,16 P1.22

### Text on the board
tNames: Main Unit Shield / V1.0 / Dan Durusky 2015